# Altium schematic sheet ZYNQ-DDR3L.SchDoc
size A3; SheetNumber: 5; SheetTotal: 9
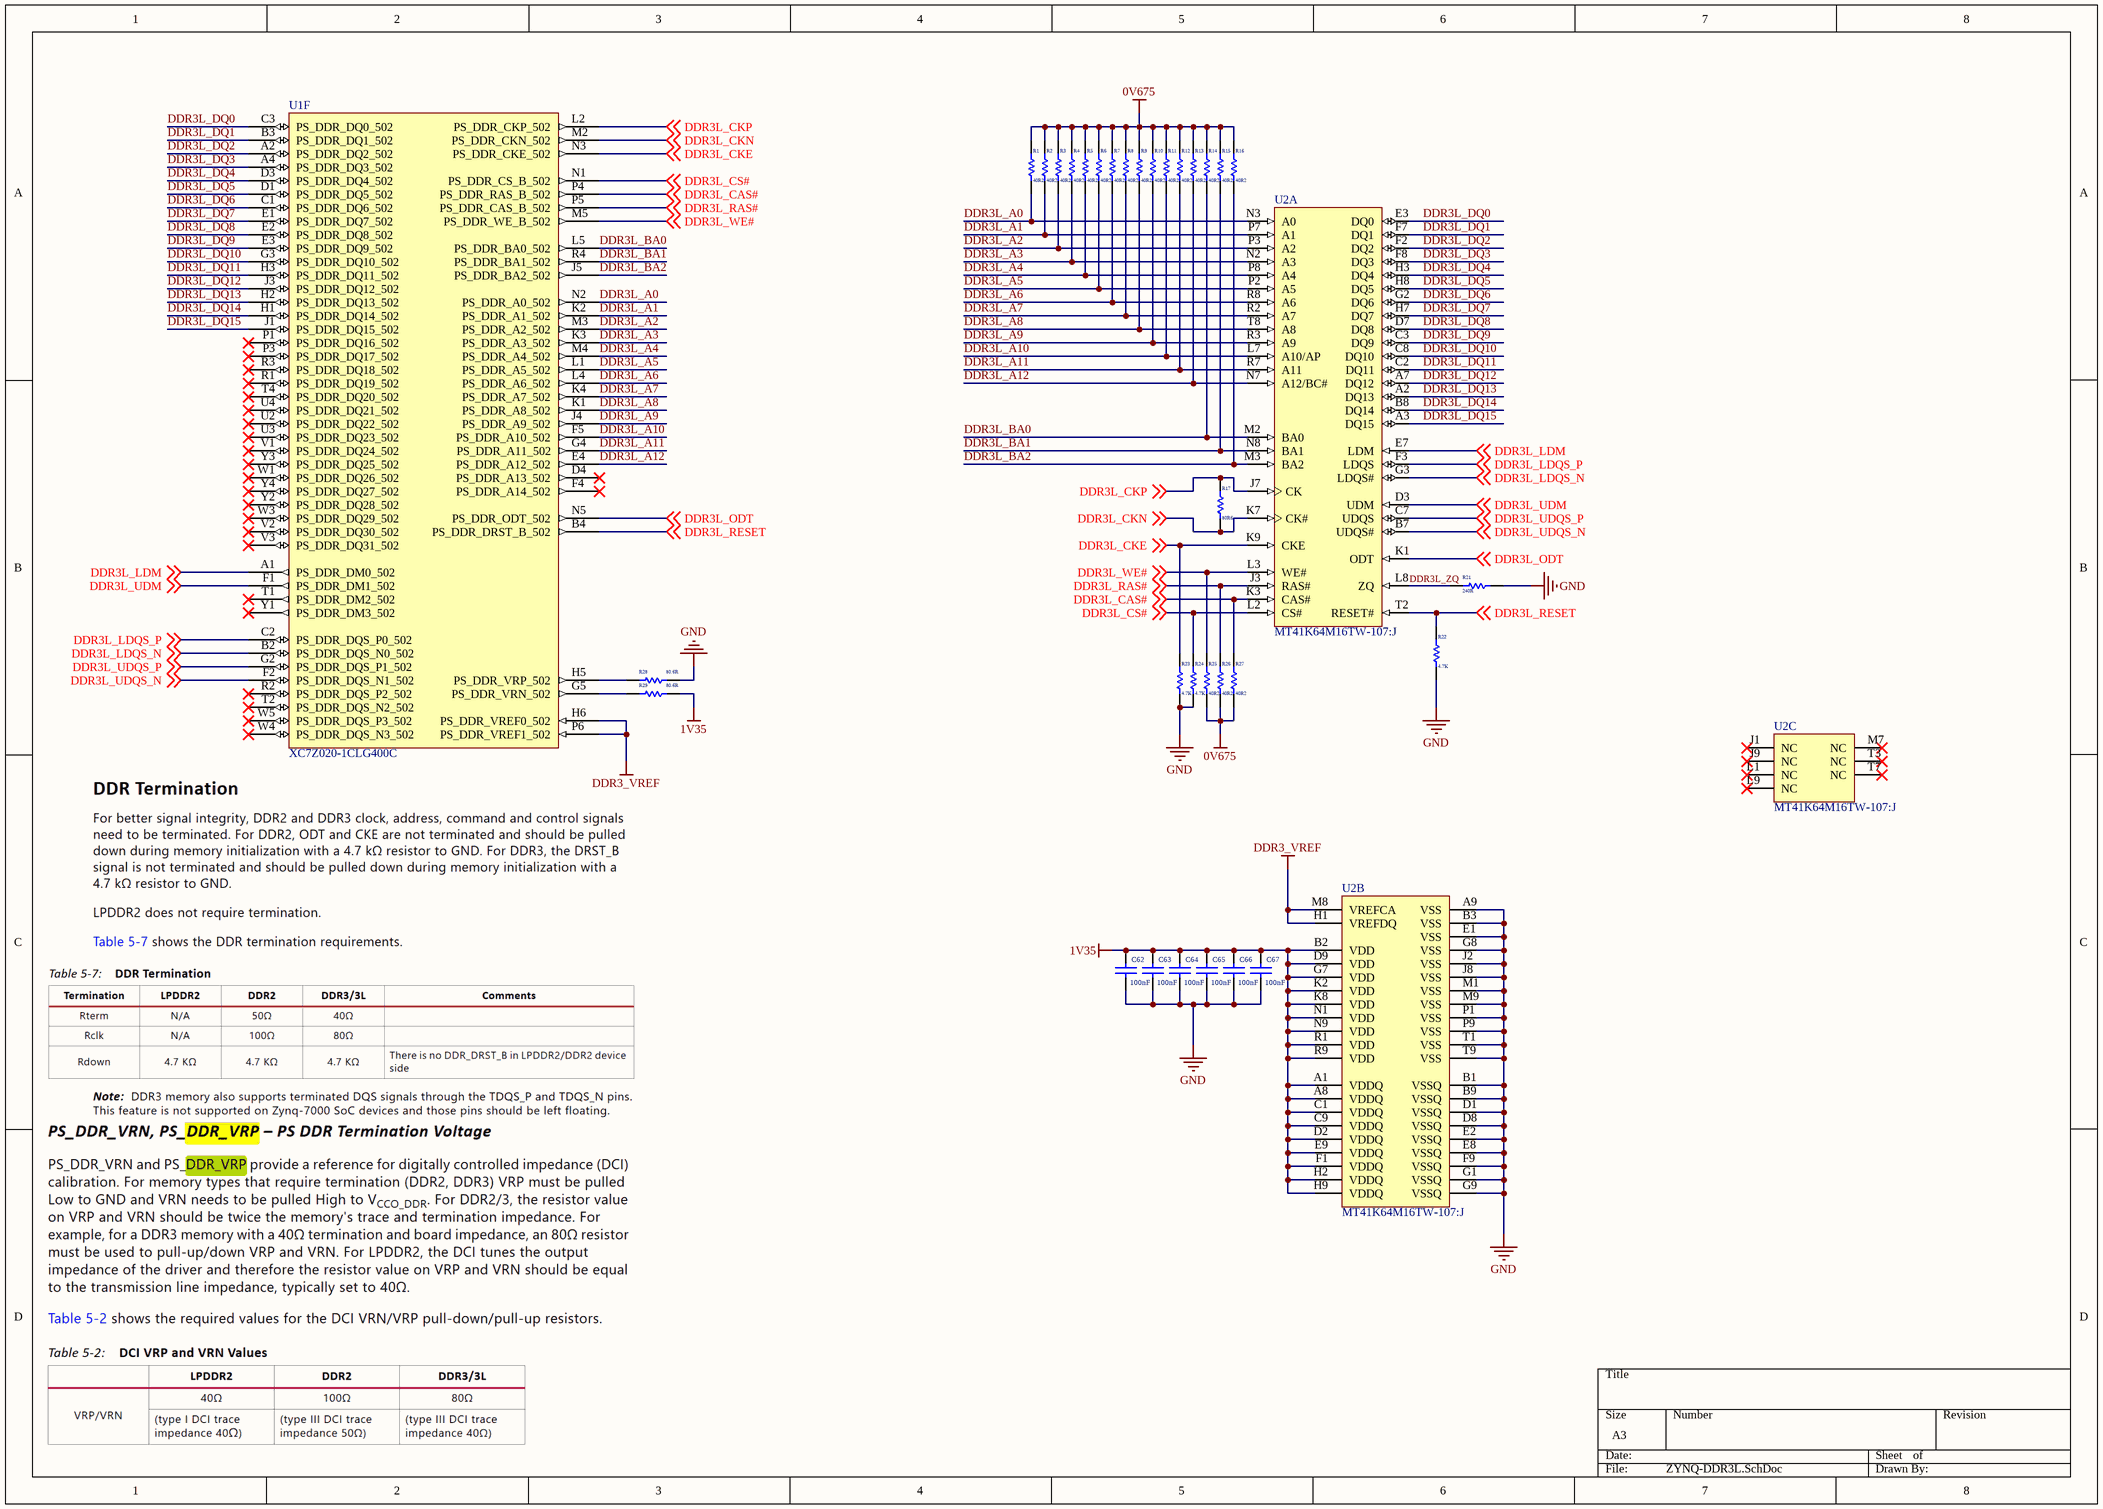
[diagram p0: ZYNQ-DDR3L.SchDoc]

## Parts
C62  100nF  [CAPC1005X55X25LL05T10]
C63  100nF  [CAPC1005X55X25LL05T10]
C64  100nF  [CAPC1005X55X25LL05T10]
C65  100nF  [CAPC1005X55X25LL05T10]
C66  100nF  [CAPC1005X55X25LL05T10]
C67  100nF  [CAPC1005X55X25LL05T10]
R1  40R2  [RESC1005X40X25LL05T05]
R2  40R2  [RESC1005X40X25LL05T05]
R3  40R2  [RESC1005X40X25LL05T05]
R4  40R2  [RESC1005X40X25LL05T05]
R5  40R2  [RESC1005X40X25LL05T05]
R6  40R2  [RESC1005X40X25LL05T05]
R7  40R2  [RESC1005X40X25LL05T05]
R8  40R2  [RESC1005X40X25LL05T05]
R9  40R2  [RESC1005X40X25LL05T05]
R10  40R2  [RESC1005X40X25LL05T05]
R11  40R2  [RESC1005X40X25LL05T05]
R12  40R2  [RESC1005X40X25LL05T05]
R13  40R2  [RESC1005X40X25LL05T05]
R14  40R2  [RESC1005X40X25LL05T05]
R15  40R2  [RESC1005X40X25LL05T05]
R16  40R2  [RESC1005X40X25LL05T05]
R17  80R6  [RESC1005X40X25LL05T05]
R21  240R  [RESC1005X40X25LL05T05]
R22  4.7K  [RESC1005X40X25LL05T05]
R23  4.7K  [RESC1005X40X25LL05T05]
R24  4.7K  [RESC1005X40X25LL05T05]
R25  40R2  [RESC1005X40X25LL05T05]
R26  40R2  [RESC1005X40X25LL05T05]
R27  40R2  [RESC1005X40X25LL05T05]
R28  80.6R  [RESC1005X40X25LL05T05]
R29  80.6R  [RESC1005X40X25LL05T05]
U1  XC7Z020-1CLG400C  [CLG400]  (part F of 9)
U2  MT41K64M16TW-107:J  [MICT-TW-96]  (parts A,B,C of 3)

## Nets
0V675: R1.2 R2.2 R3.2 R4.2 R5.2 R6.2 R7.2 R8.2 R9.2 R10.2 R11.2 R12.2 R13.2 R14.2 R15.2 R16.2 R25.1 R26.1 R27.1
1V35: C62.2 C63.2 C64.2 C65.2 C66.2 C67.2 R29.1 U2.A1(VDDQ) U2.A8(VDDQ) U2.B2(VDD) U2.C1(VDDQ) U2.C9(VDDQ) U2.D2(VDDQ) U2.D9(VDD) U2.E9(VDDQ) U2.F1(VDDQ) U2.G7(VDD) U2.H2(VDDQ) U2.H9(VDDQ) U2.K2(VDD) U2.K8(VDD) U2.N1(VDD) U2.N9(VDD) U2.R1(VDD) U2.R9(VDD)
DDR3_VREF: U1.H6(PS_DDR_VREF0_502) U1.P6(PS_DDR_VREF1_502) U2.H1(VREFDQ) U2.M8(VREFCA)
GND: C62.1 C63.1 C64.1 C65.1 C66.1 C67.1 R21.1 R22.1 R23.1 R24.1 R28.1 U2.A9(VSS) U2.B1(VSSQ) U2.B3(VSS) U2.B9(VSSQ) U2.D1(VSSQ) U2.D8(VSSQ) U2.E1(VSS) U2.E2(VSSQ) U2.E8(VSSQ) U2.F9(VSSQ) U2.G1(VSSQ) U2.G8(VSS) U2.G9(VSSQ) U2.J2(VSS) U2.J8(VSS) U2.M1(VSS) U2.M9(VSS) U2.P1(VSS) U2.P9(VSS) U2.T1(VSS) U2.T9(VSS)
DDR3L_A0: R1.1 U1.N2(PS_DDR_A0_502) U2.N3(A0)
DDR3L_A1: R2.1 U1.K2(PS_DDR_A1_502) U2.P7(A1)
DDR3L_A2: R3.1 U1.M3(PS_DDR_A2_502) U2.P3(A2)
DDR3L_A3: R4.1 U1.K3(PS_DDR_A3_502) U2.N2(A3)
DDR3L_A4: R5.1 U1.M4(PS_DDR_A4_502) U2.P8(A4)
DDR3L_A5: R6.1 U1.L1(PS_DDR_A5_502) U2.P2(A5)
DDR3L_A6: R7.1 U1.L4(PS_DDR_A6_502) U2.R8(A6)
DDR3L_A7: R8.1 U1.K4(PS_DDR_A7_502) U2.R2(A7)
DDR3L_A8: R9.1 U1.K1(PS_DDR_A8_502) U2.T8(A8)
DDR3L_A9: R10.1 U1.J4(PS_DDR_A9_502) U2.R3(A9)
DDR3L_A10: R11.1 U1.F5(PS_DDR_A10_502) U2.L7(A10/AP)
DDR3L_A11: R12.1 U1.G4(PS_DDR_A11_502) U2.R7(A11)
DDR3L_A12: R13.1 U1.E4(PS_DDR_A12_502) U2.N7(A12/BC#)
DDR3L_BA0: R14.1 U1.L5(PS_DDR_BA0_502) U2.M2(BA0)
DDR3L_BA1: R15.1 U1.R4(PS_DDR_BA1_502) U2.N8(BA1)
DDR3L_BA2: R16.1 U1.J5(PS_DDR_BA2_502) U2.M3(BA2)
DDR3L_CAS#: R27.2 U1.P4(PS_DDR_RAS_B_502) U2.K3(CAS#) ; off-sheet DDR3L_CAS#
DDR3L_CKE: R23.2 U1.N3(PS_DDR_CKE_502) U2.K9(CKE) ; off-sheet DDR3L_CKE
DDR3L_CKN: R17.1 U1.M2(PS_DDR_CKN_502) U2.K7(CK#) ; off-sheet DDR3L_CKN
DDR3L_CKP: R17.2 U1.L2(PS_DDR_CKP_502) U2.J7(CK) ; off-sheet DDR3L_CKP
DDR3L_CS#: R24.2 U1.N1(PS_DDR_CS_B_502) U2.L2(CS#) ; off-sheet DDR3L_CS#
DDR3L_DQ0: U1.C3(PS_DDR_DQ0_502) U2.E3(DQ0)
DDR3L_DQ1: U1.B3(PS_DDR_DQ1_502) U2.F7(DQ1)
DDR3L_DQ2: U1.A2(PS_DDR_DQ2_502) U2.F2(DQ2)
DDR3L_DQ3: U1.A4(PS_DDR_DQ3_502) U2.F8(DQ3)
DDR3L_DQ4: U1.D3(PS_DDR_DQ4_502) U2.H3(DQ4)
DDR3L_DQ5: U1.D1(PS_DDR_DQ5_502) U2.H8(DQ5)
DDR3L_DQ6: U1.C1(PS_DDR_DQ6_502) U2.G2(DQ6)
DDR3L_DQ7: U1.E1(PS_DDR_DQ7_502) U2.H7(DQ7)
DDR3L_DQ8: U1.E2(PS_DDR_DQ8_502) U2.D7(DQ8)
DDR3L_DQ9: U1.E3(PS_DDR_DQ9_502) U2.C3(DQ9)
DDR3L_DQ10: U1.G3(PS_DDR_DQ10_502) U2.C8(DQ10)
DDR3L_DQ11: U1.H3(PS_DDR_DQ11_502) U2.C2(DQ11)
DDR3L_DQ12: U1.J3(PS_DDR_DQ12_502) U2.A7(DQ12)
DDR3L_DQ13: U1.H2(PS_DDR_DQ13_502) U2.A2(DQ13)
DDR3L_DQ14: U1.H1(PS_DDR_DQ14_502) U2.B8(DQ14)
DDR3L_DQ15: U1.J1(PS_DDR_DQ15_502) U2.A3(DQ15)
DDR3L_LDM: U1.A1(PS_DDR_DM0_502) U2.E7(LDM) ; off-sheet DDR3L_LDM
DDR3L_LDQS_N: U1.B2(PS_DDR_DQS_N0_502) U2.G3(LDQS#) ; off-sheet DDR3L_LDQS_N
DDR3L_LDQS_P: U1.C2(PS_DDR_DQS_P0_502) U2.F3(LDQS) ; off-sheet DDR3L_LDQS_P
DDR3L_ODT: U1.N5(PS_DDR_ODT_502) U2.K1(ODT) ; off-sheet DDR3L_ODT
DDR3L_RAS#: R26.2 U1.P5(PS_DDR_CAS_B_502) U2.J3(RAS#) ; off-sheet DDR3L_RAS#
DDR3L_RESET: R22.2 U1.B4(PS_DDR_DRST_B_502) U2.T2(RESET#) ; off-sheet DDR3L_RESET
DDR3L_UDM: U1.F1(PS_DDR_DM1_502) U2.D3(UDM) ; off-sheet DDR3L_UDM
DDR3L_UDQS_N: U1.F2(PS_DDR_DQS_N1_502) U2.B7(UDQS#) ; off-sheet DDR3L_UDQS_N
DDR3L_UDQS_P: U1.G2(PS_DDR_DQS_P1_502) U2.C7(UDQS) ; off-sheet DDR3L_UDQS_P
DDR3L_WE#: R25.2 U1.M5(PS_DDR_WE_B_502) U2.L3(WE#) ; off-sheet DDR3L_WE#
DDR3L_ZQ: R21.2 U2.L8(ZQ)
NetR28_2: R28.2 U1.H5(PS_DDR_VRP_502)
NetR29_2: R29.2 U1.G5(PS_DDR_VRN_502)

Not connected (* = marked no-connect by the designer): U1 D4(PS_DDR_A13_502)* F4(PS_DDR_A14_502)* P1(PS_DDR_DQ16_502)* P3(PS_DDR_DQ17_502)* R1(PS_DDR_DQ19_502)* R2(PS_DDR_DQS_P2_502)* R3(PS_DDR_DQ18_502)* T1(PS_DDR_DM2_502)* T2(PS_DDR_DQS_N2_502)* T4(PS_DDR_DQ20_502)* U2(PS_DDR_DQ22_502)* U3(PS_DDR_DQ23_502)* U4(PS_DDR_DQ21_502)* V1(PS_DDR_DQ24_502)* V2(PS_DDR_DQ30_502)* V3(PS_DDR_DQ31_502)* W1(PS_DDR_DQ26_502)* W3(PS_DDR_DQ29_502)* W4(PS_DDR_DQS_N3_502)* W5(PS_DDR_DQS_P3_502)* Y1(PS_DDR_DM3_502)* Y2(PS_DDR_DQ28_502)* Y3(PS_DDR_DQ25_502)* Y4(PS_DDR_DQ27_502)*; U2 J1(NC)* J9(NC)* L1(NC)* L9(NC)* M7(NC)* T3(NC)* T7(NC)*

## Library data of the parts
C62-C67 = CMP-2008-04639-1: GRM155R71H104KE14D Checked / Multilayer Ceramic Capacitor, 0.1 uF, 50 V, ± 10%, X7R, 0402 [1005 Metric] Ceramic Capacitors 0.1; Manufacturer: Murata; Part Number: GRM155R71H104KE14D
R1-R17 R21-R29 = CMP-2002-00921-1: Manufacturer: Panasonic; Part Number: ERJ-2RKF40R2X
U1 = CMP-0363-00002-3: 667 MHz Zynq™-7000 AP SoC, 130 PS I/O, 125 FPGA I/O, 400-Ball BGA, Speed Grade 1, Commercial Grade, Pb-Free; Flip Flops: 106400; Speed Grade: -1; LUTs: 53200; Extensible Block RAM (# 36Kb Blocks): 560 KB (140); PackageVersion: Rev 1.1, 09/2012; ComponentLink1Description: Datasheet; ComponentLink2Description: Package Specification; ComponentLink6Description: PCB and Layout Guide; PackageDescription: Wire-Bond Chip-Scale BGA, Body 17 x 17 mm, 0.8 mm Pitch; RoHS: Pb-Free; DatasheetVersion: v1.2; Mounting Technology: Surface Mount; ComponentLink5Description: Packaging and Pinout; ComponentLink5URL: http://www.xilinx.com/support/documentation/user_guides/ug865-Zynq-7000-Pkg-Pinout.pdf; ComponentLink6URL: http://www.xilinx.com/support/documentation/user_guides/ug483_7Series_PCB.pdf; Generic Part Number: XC7Z020; ComponentLink3Description: DC and AC Switching Characteristics; ComponentLink2URL: http://www.xilinx.com/support/documentation/user_guides/ug865-Zynq-7000-Pkg-Pinout.pdf; ComponentLink4Description: Package File; ComponentLink1URL: http://www.xilinx.com/support/documentation/data_sheets/ds190-Zynq-7000-Overview.pdf; PackageReference: CLG400; ComponentLink3URL: http://www.xilinx.com/support/documentation/data_sheets/ds187-XC7Z010-XC7Z020-Data-Sheet.pdf; PartNumber: XC7Z020-1CLG400C; ComponentLink4URL: http://www.xilinx.com/support/packagefiles/z7packages/xc7z020clg400pkg.txt; Code_JEDEC: MO-275-MMAA-1
U2 = CMP-2000-06775-1: DDR3L SDRAM, 8 Meg x 16 x 8 Bank, 1.07 ns, 0 to 95 degC, 96-Ball FBGA (TW), Pb-Free; Manufacturer: Micron; Maximum Operating Current: 63mA; Operating Supply Voltage: 1.35V; Address Bus Width: 13Bit; Density: 1Gb; Lead Finish: Tin; Maximum Clock Rate: 933MHz; Organization: 64Mx16; Number of I/O Lines: 16Bit; Screening Level: Commercial; Max Processing Temp: 260; Manufacturer URL: http://www.micron.com/; Mounting Technology: SurfaceMount; Package Reference: TW-96; Datasheet Version: Rev. K, 09/2014; Operating Temperature: 0to95C; Data Bus Width: 16Bit; Datasheet URL: https://www.micron.com/~/media/documents/products/data-sheet/dram/ddr3/1gb_1_35v_ddr3l.pdf; Type: DDR3LSDRAM; Number of Bits per Word: 16Bit; Mounting: SurfaceMount; Package Description: 96-Ball Fine Pitch Ball Grid Array, Body 8 x 14 mm, Pitch 0.8 mm